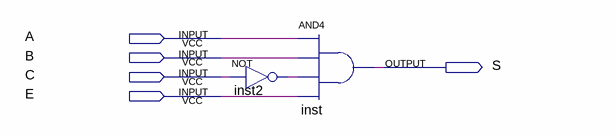
[diagram p0: schematic sheet]
// Quartus schematic Block14.bdf as structural Verilog: 2 symbols, 5 pins
module Block14 (
  input  A,
  input  B,
  input  C,
  input  E,
  output S
);

  wire inst2_out;

  and inst (S, A, B, inst2_out, E);
  not inst2 (inst2_out, C);
endmodule
